# EAGLE schematic servo_7seg (EAGLE 9.0.0)
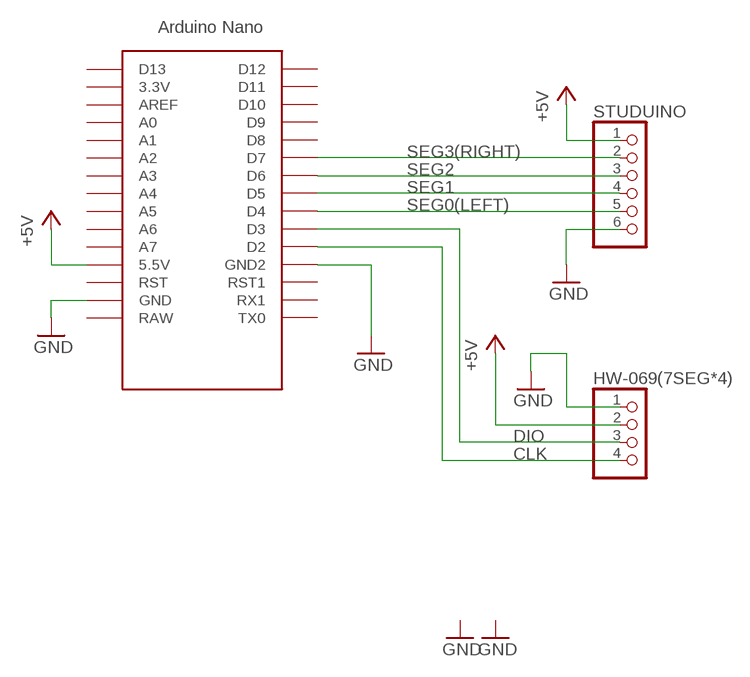
[diagram p0: schematic, sheet 1]

## Parts
HW-069(7SEG*4)  PINHD-1X4  [1X04]
STUDUINO  PINHD-1X6  [1X06]
U$1  NANO  [NANO]

## Nets
+5V: HW-069(7SEG*4).2 STUDUINO.1 U$1.5V(5.5V)
CLK: HW-069(7SEG*4).4 U$1.D2
DIO: HW-069(7SEG*4).3 U$1.D3
GND: HW-069(7SEG*4).1 STUDUINO.6 U$1.GND U$1.GND1(GND2)
SEG0(LEFT): STUDUINO.5 U$1.D4
SEG1: STUDUINO.4 U$1.D5
SEG2: STUDUINO.3 U$1.D6
SEG3(RIGHT): STUDUINO.2 U$1.D7
Unconnected: U$1.3.3V U$1.A0 U$1.A1 U$1.A2 U$1.A3 U$1.A4 U$1.A5 U$1.A6 U$1.A7 U$1.AREF U$1.D8 U$1.D9 U$1.D10 U$1.D11 U$1.D12 U$1.D13 U$1.ICSP1 U$1.ICSP2 U$1.ICSP3 U$1.ICSP4 U$1.ICSP5 U$1.ICSP6 U$1.RAW U$1.RST U$1.RST1 U$1.RX1 U$1.TX0

## Library data of the parts
HW-069(7SEG*4) = pinhead:PINHD-1X4: PIN HEADER
STUDUINO = pinhead:PINHD-1X6: PIN HEADER
U$1 = Arduino-clone:NANO: Arduino Nano